# Altium schematic sheet INDICADOR.SchDoc
size A4
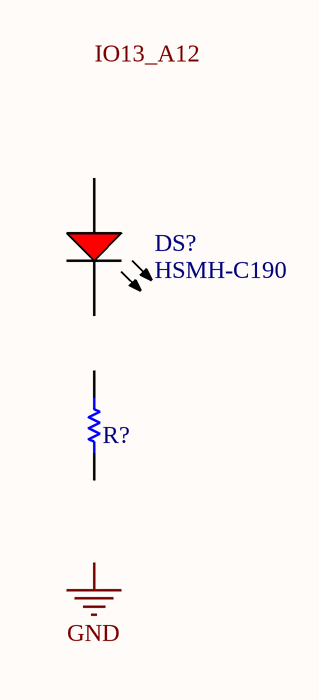
[diagram p0: INDICADOR.SchDoc]

## Parts
DS?  HSMH-C190  [AVAG-HSMX-C190_V]
R?  CRCW08051K00FKEA  [RESC2013X50X30NL20T20]  (value not drawn)

## Nets

Not connected (* = marked no-connect by the designer): DS? 1(A) 2(K); R? 1 2

## Notes on the sheet
- Labels drawn without touching a wire or pin: GND, IO13_A12

## Library data of the parts
DS? = CMP-1744-00004-1: LED Uni-Color Red, 65 mW, 20 mA, -40 to 85 degC, 2-Pin SMD, RoHS, Tape and Reel; Connector Type: USB; Gender: Male; Current Rating: 1 A; Length: 7.5 mm; Lead Pitch: 0.65 mm; PackageReference: HSMX-C190; Package Quantity: 2000; Max Operating Temperature: 85 degC; PackageDescription: 2-Pin Surface Mount Device, Body 1.6 x 0.8 mm, Height 0.9 mm; ComponentLink3Description: Package Specification; Mount: Surface Mount; Min Operating Temperature: -30 degC; ComponentLink3URL: http://www.fairchildsemi.com/dwg/MA/MA03D.pdf; ComponentLink1Description: Manufacturer URL; Contact Material: Copper; Pins: 5; Width: 5.6 mm; ComponentLink2Description: Datasheet; RoHSCompliant: true; DatasheetVersion: Mar-12; Height: 2.8 mm; Packaging: Tape and Reel; Contact Plating: Gold; ComponentLink1URL: http://www.avagotech.com/; REACH SVHC: No SVHC; ComponentLink2URL: http://docs.avagotech.com/docs/AV02-0551EN
R? = CMP-2001-03595-1: Manufacturer: Vishay Dale; Part Number: CRCW08051K00FKEA